# Altium schematic sheet power_control.SchDoc
size A; SheetNumber: 3; SheetTotal: 4
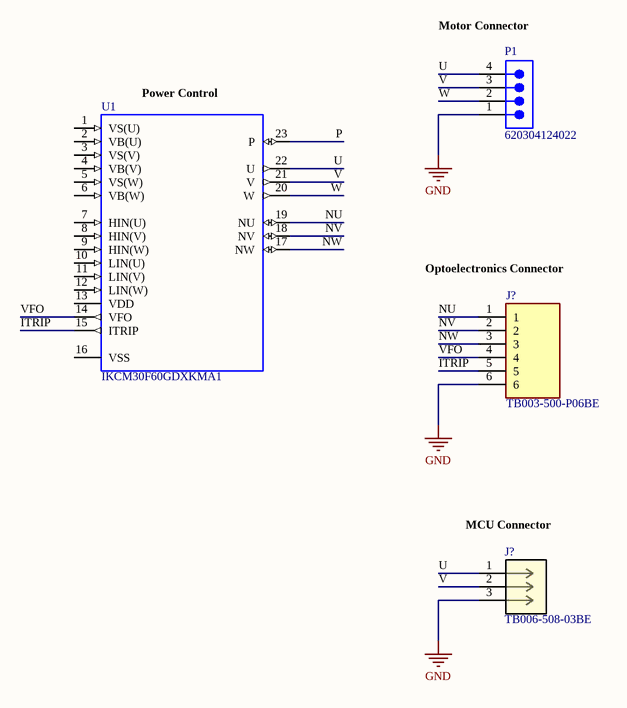
[diagram p0: power_control.SchDoc]

## Parts
(Parts that share a designator on the sheet are numbered #1, #2 ... from top to bottom, then left to right.)
J?#1  TB003-500-P06BE  [CUI_TB003-500-P06BE]
J?#2  TB006-508-03BE  [CONN3_TB006-508_CUD]
P1  620304124022  [620304124022]
U1  IKCM30F60GDXKMA1  [IC_IKCM30F60GDXKMA1]

## Nets
GND: J?#1.6 J?#2.3 P1.1
ITRIP: J?#1.5 U1.15(ITRIP)
NU: J?#1.1 U1.19(NU)
NV: J?#1.2 U1.18(NV)
NW: J?#1.3 U1.17(NW)
P: U1.23(P)
U: J?#2.1 P1.4 U1.22(U)
V: J?#2.2 P1.3 U1.21(V)
VFO: J?#1.4 U1.14(VFO)
W: P1.2 U1.20(W)

Not connected (* = marked no-connect by the designer): U1 1(VS(U)) 2(VB(U)) 3(VS(V)) 4(VB(V)) 5(VS(W)) 6(VB(W)) 7(HIN(U)) 8(HIN(V)) 9(HIN(W)) 10(LIN(U)) 11(LIN(V)) 12(LIN(W)) 13(VDD) 16(VSS)

## Notes on the sheet
- (near P1) Motor Connector
- (near U1) Power Control
- (near J?#1) Optoelectronics Connector
- (near J?#2) MCU Connector

## Library data of the parts
J?#1 = TB003-500-P06BE: 2~24 Poles, Screw Type, Horizontal, 5.0 Pitch, 26~14 (AWG), Terminal Block Connector; MF: CUI Devices; Package: None; SnapEDA_Link: https://www.snapeda.com/parts/TB003-500-P06BE/CUI+Devices/view-part/?ref=snap; Value: *; MP: TB003-500-P06BE; CUI_purchase_URL: https://www.cuidevices.com/product/interconnect/connectors/terminal-blocks/tb003-500-series?utm_source=snapeda.com&utm_medium=referral&utm_campaign=snapedaBOM; Purchase-URL: https://pricing.snapeda.com/search/part/TB003-500-P06BE/?ref=eda; Check_prices: https://www.snapeda.com/parts/TB003-500-P06BE/CUI+Devices/view-part/?ref=eda; Digi-Key_Part_Number: 102-6165-ND
J?#2 = TB006-508-03BE: No Description Available; Mfr_Name: Same Sky; Type: Wire to Board; RefDes: RefDes
P1 = CMP-1502-00662-2: NexarPartId: 18818244; Insulation: Insulated; Number of Contacts: 4; Connector Type: Male Pin; Contact Resistance: 20mΩ; Current Rating: 2A; Insulation Resistance: 1GΩ; Operating Supply Voltage: 100V; Pitch: 2mm; Voltage Rating: 125V; Gender: Male; Packaging: Tape and Reel; Number of Rows: 1; Height: 6.6mm; Width: 11.9mm; Number of Pins: 4; Contact Plating: Tin; Contact Mating Length: 3.5052mm; Flammability Rating: UL94 V-0; Color: Beige, White; Contact Gender: Male; Orientation: Vertical; Contact Material: Copper; Max Operating Temperature: 85°C; RoHS: Compliant; Number of Positions: 4; Lead Pitch: 2mm; Min Operating Temperature: -40°C; Length: 9mm; Termination: SMD/SMT; Housing Material: Nylon; REACH SVHC: Unknown; Lead Free: Lead Free; Mount: Surface Mount
U1 = IKCM30F60GDXKMA1: Fully isolated Dual In-Line molded module; MF: Infineon Technologies; Package: PowerDIP-24 Infineon; Price: None; Check_prices: https://www.snapeda.com/parts/IKCM30F60GDXKMA1/Infineon+Technologies/view-part/?ref=eda; Value: *; SnapEDA_Link: https://www.snapeda.com/parts/IKCM30F60GDXKMA1/Infineon+Technologies/view-part/?ref=snap; MP: IKCM30F60GDXKMA1; Availability: In Stock; Purchase-URL: https://pricing.snapeda.com/search?q=IKCM30F60GDXKMA1&ref=eda